# EAGLE design biosignal-daq-v1.0 (EAGLE 9.0.1)

## Sheet 1 of 2
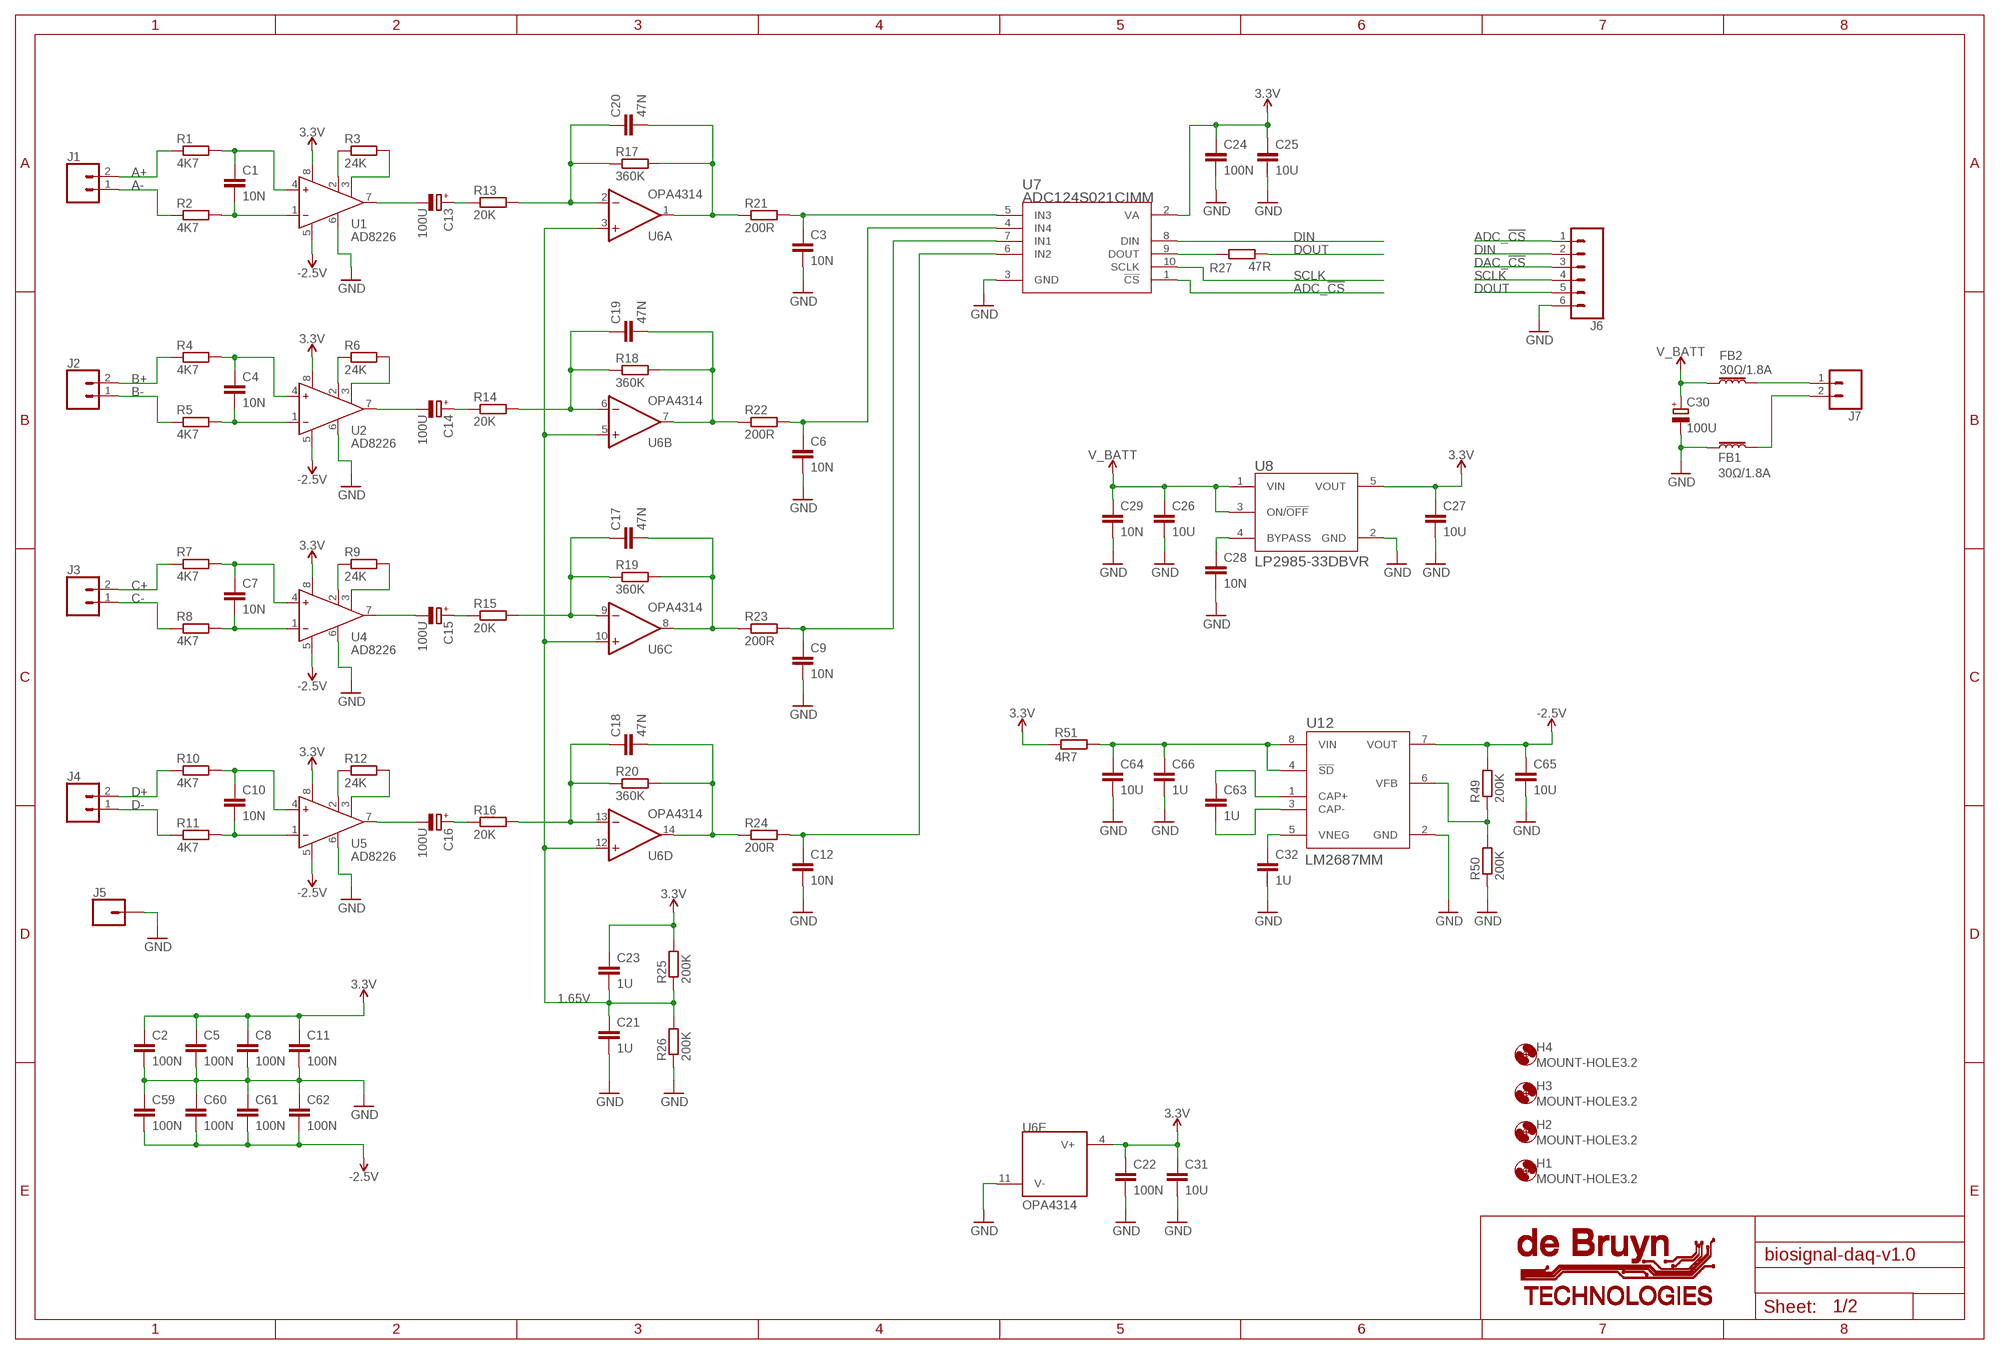
[diagram p0: schematic, sheet 1]

### Parts
C1  10N  C0603  [CAPC160X80X91L36N]
C2  100N  C0603  [CAPC160X80X91L36N]
C3  10N  C0603  [CAPC160X80X91L36N]
C4  10N  C0603  [CAPC160X80X91L36N]
C5  100N  C0603  [CAPC160X80X91L36N]
C6  10N  C0603  [CAPC160X80X91L36N]
C7  10N  C0603  [CAPC160X80X91L36N]
C8  100N  C0603  [CAPC160X80X91L36N]
C9  10N  C0603  [CAPC160X80X91L36N]
C10  10N  C0603  [CAPC160X80X91L36N]
C11  100N  C0603  [CAPC160X80X91L36N]
C12  10N  C0603  [CAPC160X80X91L36N]
C13  100U  CPOL-EUE2-5  [E2-5]
C14  100U  CPOL-EUE2-5  [E2-5]
C15  100U  CPOL-EUE2-5  [E2-5]
C16  100U  CPOL-EUE2-5  [E2-5]
C17  47N  C0805  [CAPC200X125X80L50N]
C18  47N  C0805  [CAPC200X125X80L50N]
C19  47N  C0805  [CAPC200X125X80L50N]
C20  47N  C0805  [CAPC200X125X80L50N]
C21  1U  C0603  [CAPC160X80X91L36N]
C22  100N  C0603  [CAPC160X80X91L36N]
C23  1U  C0603  [CAPC160X80X91L36N]
C24  100N  C0603  [CAPC160X80X91L36N]
C25  10U  C0805  [CAPC200X125X80L50N]
C26  10U  C0805  [CAPC200X125X80L50N]
C27  10U  C0805  [CAPC200X125X80L50N]
C28  10N  C0603  [CAPC160X80X91L36N]
C29  10N  C0603  [CAPC160X80X91L36N]
C30  100U  CPOL-EUE2-5  [E2-5]
C31  10U  C0805  [CAPC200X125X80L50N]
C32  1U  C0603  [CAPC160X80X91L36N]
C59  100N  C0603  [CAPC160X80X91L36N]
C60  100N  C0603  [CAPC160X80X91L36N]
C61  100N  C0603  [CAPC160X80X91L36N]
C62  100N  C0603  [CAPC160X80X91L36N]
C63  1U  C0603  [CAPC160X80X91L36N]
C64  10U  C0805  [CAPC200X125X80L50N]
C65  10U  C0805  [CAPC200X125X80L50N]
C66  1U  C0603  [CAPC160X80X91L36N]
FB1  30Ω/1.8A  FERRITE_BEAD-0603  [0603]
FB2  30Ω/1.8A  FERRITE_BEAD-0603  [0603]
H1  MOUNT-HOLE3.2  [3,2]
H2  MOUNT-HOLE3.2  [3,2]
H3  MOUNT-HOLE3.2  [3,2]
H4  MOUNT-HOLE3.2  [3,2]
J1  CONN_021X02_NO_SILK  [1X02_NO_SILK]
J2  CONN_021X02_NO_SILK  [1X02_NO_SILK]
J3  CONN_021X02_NO_SILK  [1X02_NO_SILK]
J4  CONN_021X02_NO_SILK  [1X02_NO_SILK]
J5  CONN_01  [1X01]
J6  CONN_06NO_SILK_NO_POP  [1X06_NO_SILK]
J7  CONN_021X02_NO_SILK  [1X02_NO_SILK]
R1  4K7  R0603  [RESC160X80X55L25N]
R2  4K7  R0603  [RESC160X80X55L25N]
R3  24K  R0603  [RESC160X80X55L25N]
R4  4K7  R0603  [RESC160X80X55L25N]
R5  4K7  R0603  [RESC160X80X55L25N]
R6  24K  R0603  [RESC160X80X55L25N]
R7  4K7  R0603  [RESC160X80X55L25N]
R8  4K7  R0603  [RESC160X80X55L25N]
R9  24K  R0603  [RESC160X80X55L25N]
R10  4K7  R0603  [RESC160X80X55L25N]
R11  4K7  R0603  [RESC160X80X55L25N]
R12  24K  R0603  [RESC160X80X55L25N]
R13  20K  R0603  [RESC160X80X55L25N]
R14  20K  R0603  [RESC160X80X55L25N]
R15  20K  R0603  [RESC160X80X55L25N]
R16  20K  R0603  [RESC160X80X55L25N]
R17  360K  R0603  [RESC160X80X55L25N]
R18  360K  R0603  [RESC160X80X55L25N]
R19  360K  R0603  [RESC160X80X55L25N]
R20  360K  R0603  [RESC160X80X55L25N]
R21  200R  R0603  [RESC160X80X55L25N]
R22  200R  R0603  [RESC160X80X55L25N]
R23  200R  R0603  [RESC160X80X55L25N]
R24  200R  R0603  [RESC160X80X55L25N]
R25  200K  R0603  [RESC160X80X55L25N]
R26  200K  R0603  [RESC160X80X55L25N]
R27  47R  R0603  [RESC160X80X55L25N]
R49  200K  R0603  [RESC160X80X55L25N]
R50  200K  R0603  [RESC160X80X55L25N]
R51  4R7  R0603  [RESC160X80X55L25N]
U1  AD8226  [SOP8P65_300X490X95L60X32N]
U2  AD8226  [SOP8P65_300X490X95L60X32N]
U4  AD8226  [SOP8P65_300X490X95L60X32N]
U5  AD8226  [SOP8P65_300X490X95L60X32N]
U6  OPA4314  [PW14]
U7  ADC124S021CIMM  [MUB10A]
U8  LP2985-33DBVR  [DBV5]
U12  LM2687MM  [MUA08A]

### Nets
1.65V: C21.1 C23.2 R25.1 R26.2 U6.3(A:+IN) U6.5(B:+IN) U6.10(C:+IN) U6.12(D:+IN)
3.3V: C2.1 C5.1 C8.1 C11.1 C22.1 C23.1 C24.1 C25.1 C27.1 C31.1 R25.2 R51.1 U1.8(+VS) U2.8(+VS) U4.8(+VS) U5.8(+VS) U6.4(E:V+) U7.2(VA) U8.5(VOUT) ; also sheet 2
-2.5V: C59.2 C60.2 C61.2 C62.2 C65.1 R49.2 U1.5(-VS) U2.5(-VS) U4.5(-VS) U5.5(-VS) U12.7(VOUT)
A+: J1.2 R1.1
A-: J1.1 R2.1
ADC_!CS: J6.1 U7.1(!CS)
B+: J2.2 R4.1
B-: J2.1 R5.1
C+: J3.2 R7.1
C-: J3.1 R8.1
D+: J4.2 R10.1
D-: J4.1 R11.1
DAC_!CS: J6.3 ; also sheet 2
DIN: J6.2 U7.8(DIN) ; also sheet 2
DOUT: J6.5 R27.2
GND: C2.2 C3.2 C5.2 C6.2 C8.2 C9.2 C11.2 C12.2 C21.2 C22.2 C24.2 C25.2 C26.2 C27.2 C28.2 C29.2 C30.- C31.2 C32.2 C59.1 C60.1 C61.1 C62.1 C64.2 C65.2 C66.2 FB1.1 J5.1 J6.6 R26.1 R50.1 U1.6(REF) U2.6(REF) U4.6(REF) U5.6(REF) U6.11(E:V-) U7.3(GND) U8.2(GND) U12.2(GND) ; also sheet 2
N$1: C1.1 R1.2 U1.4(IN+)
N$2: C1.2 R2.2 U1.1(IN-)
N$3: R3.1 U1.2(RG)
N$4: R3.2 U1.3(RG)
N$5: C4.1 R4.2 U2.4(IN+)
N$6: C4.2 R5.2 U2.1(IN-)
N$7: R6.1 U2.2(RG)
N$8: R6.2 U2.3(RG)
N$11: C7.1 R7.2 U4.4(IN+)
N$12: C7.2 R8.2 U4.1(IN-)
N$13: R9.1 U4.2(RG)
N$14: R9.2 U4.3(RG)
N$17: C10.1 R10.2 U5.4(IN+)
N$18: C10.2 R11.2 U5.1(IN-)
N$19: R12.1 U5.2(RG)
N$20: R12.2 U5.3(RG)
N$23: C13.- U1.7(VOUT)
N$24: C13.+ R13.1
N$27: C14.- U2.7(VOUT)
N$28: C14.+ R14.1
N$29: C15.- U4.7(VOUT)
N$30: C15.+ R15.1
N$31: C16.- U5.7(VOUT)
N$32: C16.+ R16.1
N$33: C6.1 R22.2 U7.4(IN4)
N$34: C19.1 R14.2 R18.1 U6.6(B:-IN)
N$35: C18.1 R16.2 R20.1 U6.13(D:-IN)
N$36: C18.2 R20.2 R24.1 U6.14(D:OUT)
N$37: C17.1 R15.2 R19.1 U6.9(C:-IN)
N$38: C17.2 R19.2 R23.1 U6.8(C:OUT)
N$39: C19.2 R18.2 R22.1 U6.7(B:OUT)
N$40: C20.1 R13.2 R17.1 U6.2(A:-IN)
N$41: C20.2 R17.2 R21.1 U6.1(A:OUT)
N$42: C9.1 R23.2 U7.7(IN1)
N$43: C12.1 R24.2 U7.6(IN2)
N$44: C3.1 R21.2 U7.5(IN3)
N$47: R27.1 U7.9(DOUT)
N$48: FB2.2 J7.1
N$49: FB1.2 J7.2
N$50: C28.1 U8.4(BYPASS)
N$81: R49.1 R50.2 U12.6(VFB)
N$82: C64.1 C66.1 R51.2 U12.4(!SD) U12.8(VIN)
N$83: C63.1 U12.1(CAP+)
N$85: C63.2 U12.3(CAP-)
N$86: C32.1 U12.5(VNEG)
SCLK: J6.4 U7.10(SCLK) ; also sheet 2
V_BATT: C26.1 C29.1 C30.+ FB2.1 U8.1(VIN) U8.3(ON/!OFF)

## Sheet 2 of 2
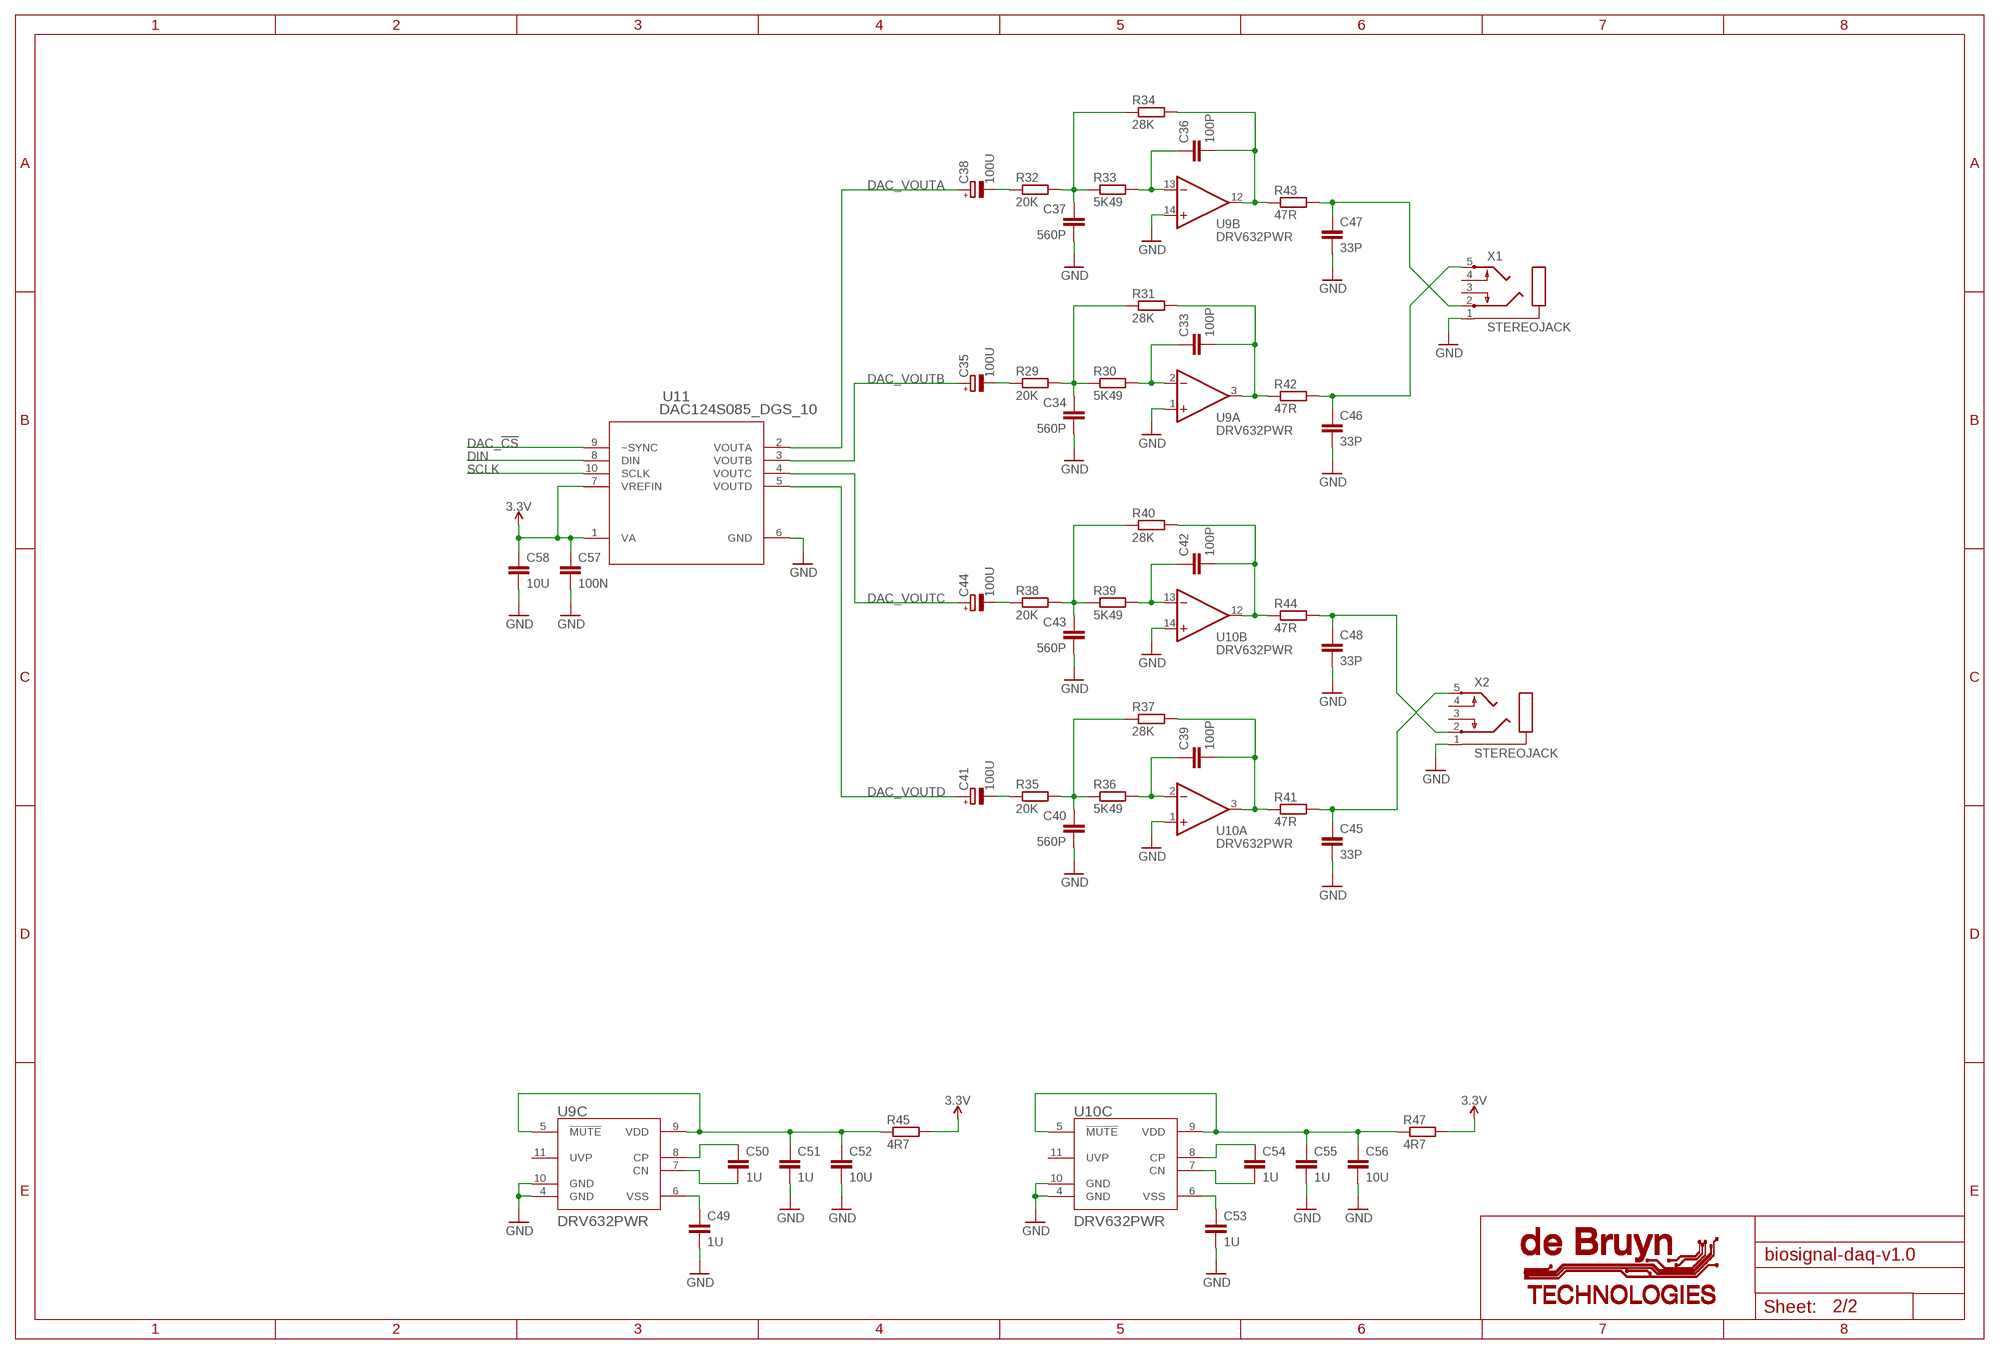
[diagram p1: schematic, sheet 2]

### Parts
C33  100P  C0603  [CAPC160X80X91L36N]
C34  560P  C0603  [CAPC160X80X91L36N]
C35  100U  CPOL-EUE2-5  [E2-5]
C36  100P  C0603  [CAPC160X80X91L36N]
C37  560P  C0603  [CAPC160X80X91L36N]
C38  100U  CPOL-EUE2-5  [E2-5]
C39  100P  C0603  [CAPC160X80X91L36N]
C40  560P  C0603  [CAPC160X80X91L36N]
C41  100U  CPOL-EUE2-5  [E2-5]
C42  100P  C0603  [CAPC160X80X91L36N]
C43  560P  C0603  [CAPC160X80X91L36N]
C44  100U  CPOL-EUE2-5  [E2-5]
C45  33P  C0603  [CAPC160X80X91L36N]
C46  33P  C0603  [CAPC160X80X91L36N]
C47  33P  C0603  [CAPC160X80X91L36N]
C48  33P  C0603  [CAPC160X80X91L36N]
C49  1U  C0603  [CAPC160X80X91L36N]
C50  1U  C0603  [CAPC160X80X91L36N]
C51  1U  C0603  [CAPC160X80X91L36N]
C52  10U  C0805  [CAPC200X125X80L50N]
C53  1U  C0603  [CAPC160X80X91L36N]
C54  1U  C0603  [CAPC160X80X91L36N]
C55  1U  C0603  [CAPC160X80X91L36N]
C56  10U  C0805  [CAPC200X125X80L50N]
C57  100N  C0603  [CAPC160X80X91L36N]
C58  10U  C0805  [CAPC200X125X80L50N]
R29  20K  R0603  [RESC160X80X55L25N]
R30  5K49  R0603  [RESC160X80X55L25N]
R31  28K  R0603  [RESC160X80X55L25N]
R32  20K  R0603  [RESC160X80X55L25N]
R33  5K49  R0603  [RESC160X80X55L25N]
R34  28K  R0603  [RESC160X80X55L25N]
R35  20K  R0603  [RESC160X80X55L25N]
R36  5K49  R0603  [RESC160X80X55L25N]
R37  28K  R0603  [RESC160X80X55L25N]
R38  20K  R0603  [RESC160X80X55L25N]
R39  5K49  R0603  [RESC160X80X55L25N]
R40  28K  R0603  [RESC160X80X55L25N]
R41  47R  R0603  [RESC160X80X55L25N]
R42  47R  R0603  [RESC160X80X55L25N]
R43  47R  R0603  [RESC160X80X55L25N]
R44  47R  R0603  [RESC160X80X55L25N]
R45  4R7  R0603  [RESC160X80X55L25N]
R47  4R7  R0603  [RESC160X80X55L25N]
U9  DRV632PWR  [PW14]
U10  DRV632PWR  [PW14]
U11  DAC124S085_DGS_10  [MUB10A]
X1  STEREOJACK  [STX3100]
X2  STEREOJACK  [STX3100]

### Nets
3.3V: C57.1 C58.1 R45.2 R47.2 U11.1(VA) U11.7(VREFIN) ; also sheet 1
DAC_!CS: U11.9(~SYNC) ; also sheet 1
DAC_VOUTA: C38.+ U11.2(VOUTA)
DAC_VOUTB: C35.+ U11.3(VOUTB)
DAC_VOUTC: C44.+ U11.4(VOUTC)
DAC_VOUTD: C41.+ U11.5(VOUTD)
DIN: U11.8(DIN) ; also sheet 1
GND: C34.2 C37.2 C40.2 C43.2 C45.2 C46.2 C47.2 C48.2 C49.2 C51.2 C52.2 C53.2 C55.2 C56.2 C57.2 C58.2 U9.1(A:+IN) U9.4(C:GND) U9.10(C:GND) U9.14(B:+IN) U10.1(A:+IN) U10.4(C:GND) U10.10(C:GND) U10.14(B:+IN) U11.6(GND) X1.1 X2.1 ; also sheet 1
N$45: C47.1 R43.2 X1.2
N$46: C34.1 R29.2 R30.1 R31.1
N$52: C33.1 R30.2 U9.2(A:-IN)
N$53: C33.2 R31.2 R42.1 U9.3(A:OUT)
N$54: C35.- R29.1
N$55: C37.1 R32.2 R33.1 R34.1
N$56: C36.1 R33.2 U9.13(B:-IN)
N$57: C36.2 R34.2 R43.1 U9.12(B:OUT)
N$58: C38.- R32.1
N$59: C40.1 R35.2 R36.1 R37.1
N$60: C39.1 R36.2 U10.2(A:-IN)
N$61: C39.2 R37.2 R41.1 U10.3(A:OUT)
N$62: C41.- R35.1
N$63: C43.1 R38.2 R39.1 R40.1
N$64: C42.1 R39.2 U10.13(B:-IN)
N$65: C42.2 R40.2 R44.1 U10.12(B:OUT)
N$66: C44.- R38.1
N$67: C45.1 R41.2 X2.5
N$68: C46.1 R42.2 X1.5
N$70: C48.1 R44.2 X2.2
N$71: C50.1 U9.8(C:CP)
N$72: C50.2 U9.7(C:CN)
N$73: C49.1 U9.6(C:VSS)
N$75: C51.1 C52.1 R45.1 U9.5(C:!MUTE) U9.9(C:VDD)
N$76: C54.1 U10.8(C:CP)
N$77: C54.2 U10.7(C:CN)
N$78: C53.1 U10.6(C:VSS)
N$80: C55.1 C56.1 R47.1 U10.5(C:!MUTE) U10.9(C:VDD)
SCLK: U11.10(SCLK) ; also sheet 1
Unconnected: U9.11(C:UVP) U10.11(C:UVP) X1.3 X1.4 X2.3 X2.4

## Library data of the parts
C1 C3 C4 C6 C7 C9 C10 C12 C17-C21 C23 C25-C29 C31-C34 C36 C37 C39 C40 C42 C43 C45-C58 C63-C66 = plantsensor:C
C2 C5 C8 C11 C22 C24 C59-C62 = plantsensor:C; MANUFACTURER_PART_NUMBER: MC0603B104K100CT; RATING: 10V; TECHNOLOGY: X7R; TOLERANCE: 10%; VENDOR: Multicomp
C13-C16 C30 C35 C38 C41 C44 = rcl:CPOL-EU: POLARIZED CAPACITOR, European symbol; SPICEPREFIX: C
FB1 FB2 = SparkFun-Coils:FERRITE_BEAD: Ferrite Bead (blocks, cores, rings, chokes, etc.) Inductor with layers of ferrite used to suppress high frequencies. Often used to isolate high frequency noise. SparkFun Products: IOIO-OTG - V2.2 <https://www.sparkfun.com/products/13613> SparkFun SAMD21 Mini Breakout <https://www.sparkfun.com/products/13664> SparkFun 6 Degrees of Freedom Breakout - LSM6DS3 <https://www.sparkfun.com/products/13339> SparkFun SAMD21 Dev Breakout <https://www.sparkfun.com/products/13672>; PROD_ID: NDUC-07859
H1-H4 = holes:MOUNT-HOLE: MOUNTING HOLE with drill center marker
J1-J4 J7 = SparkFun-Connectors:CONN_02: Multi connection point. Often used as Generic Header-pin footprint for 0.1 inch spaced/style header connections On any of the 0.1 inch spaced packages, you can populate with these: Break Away Headers - Straight <https://www.sparkfun.com/products/116> (PRT-00116) Break Away Male Headers - Right Angle <https://www.sparkfun.com/products/553> (PRT-00553) Female Headers <https://www.sparkfun.com/products/115> (PRT-00115) Break Away Headers - Machine Pin <https://www.sparkfun.com/products/117> (PRT-00117) Break Away Female Headers - Swiss Machine Pin <https://www.sparkfun.com/products/743> (PRT-00743) For SCREWTERMINALS and SPRING TERMINALS visit here: Screw Terimnals on SparkFun.com <https://www.sparkfun.com/search/results?term=Screw+Terminals> (5mm/3.5mm/2.54mm spacing) This device is also useful as a general connection point to wire up your design to another part of your project. Our various solder wires solder well into these plated through hole pads. Hook-Up Wire - Assortment (Stranded, 22 AWG) <https://www.sparkfun.com/products/11375> (PRT-11375) Hook-Up Wire - Assortment (Solid Core, 22 AWG) <https://www.sparkfun.com/products/11367> (PRT-11367) View the entire wire category on our website here <https://www.sparkfun.com/categories/141> Special notes: Molex polarized connector foot print use with: PRT-08233 with associated crimp pins and housings. 2.54_SCREWTERM for use with PRT-10571. 3.5mm Screw Terminal footprints for PRT-08084 5mm Screw Terminal footprints for use with PRT-08432
J5 = SparkFun-Connectors:CONN_01: Single connection point. Often used as Generic Header-pin footprint for 0.1 inch spaced/style header connections On any of the 0.1 inch spaced packages, you can populate with these: Break Away Headers - Straight <https://www.sparkfun.com/products/116> (PRT-00116) Break Away Male Headers - Right Angle <https://www.sparkfun.com/products/553> (PRT-00553) Female Headers <https://www.sparkfun.com/products/115> (PRT-00115) Break Away Headers - Machine Pin <https://www.sparkfun.com/products/117> (PRT-00117) Break Away Female Headers - Swiss Machine Pin <https://www.sparkfun.com/products/743> (PRT-00743) This device is also useful as a general connection point to wire up your design to another part of your project. Our various solder wires solder well into these plated through hole pads. Hook-Up Wire - Assortment (Stranded, 22 AWG) <https://www.sparkfun.com/products/11375> (PRT-11375) Hook-Up Wire - Assortment (Solid Core, 22 AWG) <https://www.sparkfun.com/products/11367> (PRT-11367) View the entire wire category on our website here <https://www.sparkfun.com/categories/141> Special notes: SMTSO-256-ET is a "flush mount" nut for a 4-40 screw. We mostly use this on specialty testbeds; it is a nice way to connect hardware to your PCB at an adjustable hieght. Also note, the SNAP packages are for using a snappable style connector. We sell a baggie of snaps and they are also used on two LilyPad designs: Snap Assortment - 30 pack (male and female) <https://www.sparkfun.com/products/11347> (DEV-11347) LilyPad Arduino SimpleSnap <https://www.sparkfun.com/products/10941> (DEV-10941) LilyPad SimpleSnap Protoboard <https://www.sparkfun.com/products/10940> (DEV-10940)
J6 = SparkFun-Connectors:CONN_06: Multi connection point. Often used as Generic Header-pin footprint for 0.1 inch spaced/style header connections On any of the 0.1 inch spaced packages, you can populate with these: Break Away Headers - Straight <https://www.sparkfun.com/products/116> (PRT-00116) Break Away Male Headers - Right Angle <https://www.sparkfun.com/products/553> (PRT-00553) Female Headers <https://www.sparkfun.com/products/115> (PRT-00115) Break Away Headers - Machine Pin <https://www.sparkfun.com/products/117> (PRT-00117) Break Away Female Headers - Swiss Machine Pin <https://www.sparkfun.com/products/743> (PRT-00743) Arduino Stackable Header - 6 Pin <https://www.sparkfun.com/products/9280> (PRT-09280) For SCREWTERMINALS and SPRING TERMINALS visit here: Screw Terimnals on SparkFun.com <https://www.sparkfun.com/search/results?term=Screw+Terminals> (5mm/3.5mm/2.54mm spacing) This device is also useful as a general connection point to wire up your design to another part of your project. Our various solder wires solder well into these plated through hole pads. Hook-Up Wire - Assortment (Stranded, 22 AWG) <https://www.sparkfun.com/products/11375> (PRT-11375) Hook-Up Wire - Assortment (Solid Core, 22 AWG) <https://www.sparkfun.com/products/11367> (PRT-11367) View the entire wire category on our website here <https://www.sparkfun.com/categories/141>
R1-R4 = plantsensor:R; RATING: 100mW; TOLERANCE: 1%
R5-R27 R29-R45 R47 R49-R51 = plantsensor:R
U1 U2 U4 U5 = plantsensor:AD8226
U6 = plantsensor:OPA4314
U7 = plantsensor:ADC124S021CIMM; MANUFACTURER_PART_NUMBER: ADC124S021CIMM; VENDOR: Texas Instruments
U8 = plantsensor:LP2985-33DBVR; MANUFACTURER_PART_NUMBER: LP298533DBVR; VENDOR: Texas Instruments
U9 U10 = plantsensor:DRV632PWR; MANUFACTURER_PART_NUMBER: DRV632PWR; VENDOR: Texas Instruments
U11 = plantsensor:DAC124S085_DGS_10; MANUFACTURER_PART_NUMBER: DAC124S085_DGS_10; VENDOR: Texas Instruments
U12 = plantsensor:LM2687MM; MANUFACTURER_PART_NUMBER: LM2687MM; VENDOR: Texas Instruments
X1 X2 = audio amplifier example:STEREOJACK: MIC/HEADPHONE JACK Stereo jack with two switches. Kycon STX3100, CUI SJ1-3555NG and/or 4UCon 05544

## Board
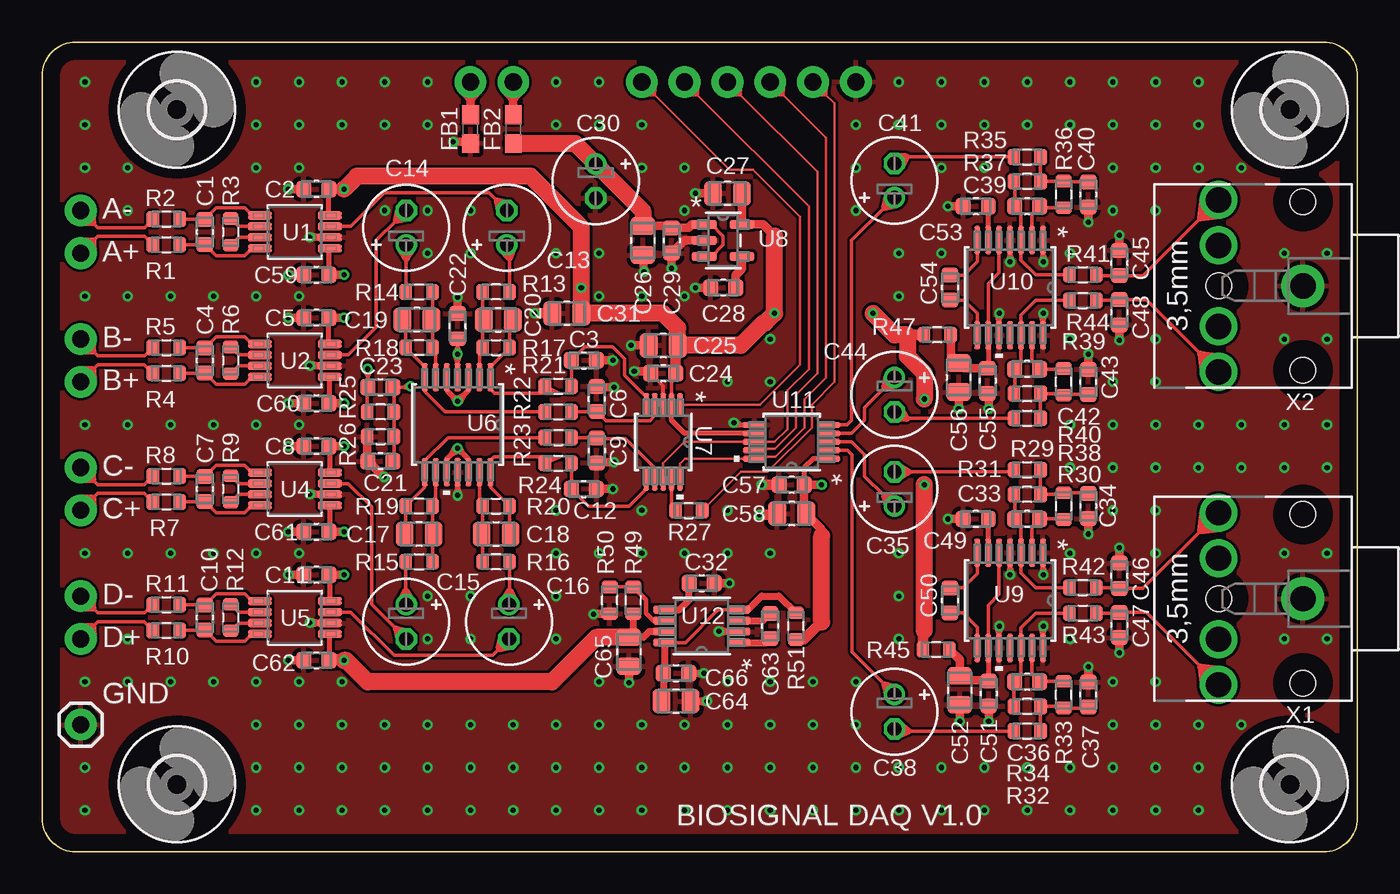
[diagram p2: board, top side]
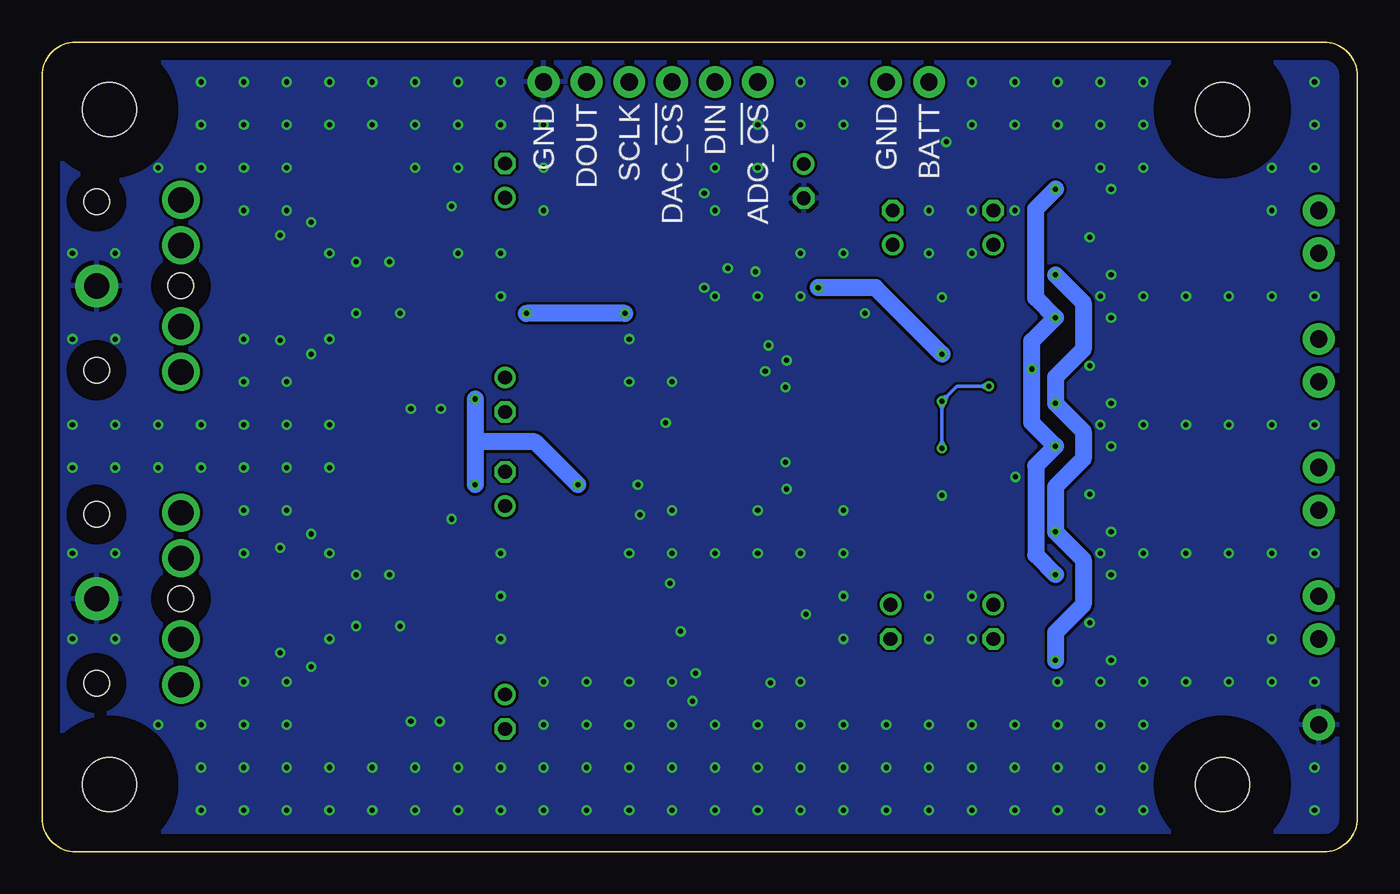
[diagram p3: board, bottom side, seen from below]

Size 78 x 48 mm. Coordinates in mm from the lower left corner, seen from the top.
Outline: 0,2 0,46 arc-90 2,48 76,48 arc-90 78,46 78,2 arc-90 76,0 2,0 arc-90 0,2
Copper layers (1*16): Top 0.035mm / dielectric 1.5mm / Bottom 0.035mm
Design rules "default *": minimum track width 6mil, minimum drill 0.3mm, track to track 6mil, track to pad 6mil, pad to pad 6mil, via to via 6mil, smd to smd 6mil, copper to edge 40mil, drill to drill 6mil, minimum pad ring 6mil, minimum via ring 6mil, stop-mask expansion 0.07mm, vias tented up to drill 0.3mm, thermal gap 10mil

### Footprints (pad centres in the part's own frame; a part is rotated, then mirrored left to right if it is on the bottom)
CAPC160X80X91L36N = smd 0.88 x 0.97: 1 -0.745,0; 2 0.745,0
E2-5 = drill 0.813 pad 1.27: + -1.016,0 | drill 0.813 pad 1.27 octagon: - 1.016,0
CAPC200X125X80L50N = smd 1.05 x 1.42: 1 -0.86,0; 2 0.86,0
0603 = smd 1.1 x 1: 1 -0.85,0; 2 0.85,0
3,2 = hole 3.2: 0,0
1X02_NO_SILK = drill 1.016 pad 1.88: 1 0,0; 2 2.54,0
1X01 = drill 1.016 pad 1.88: 1 0,0
1X06_NO_SILK = drill 1.016 pad 1.88: 1 0,0; 2 2.54,0; 3 5.08,0; 4 7.62,0; 5 10.16,0; 6 12.7,0
RESC160X80X55L25N = smd 0.74 x 0.93: 1 -0.795,0; 2 0.795,0
SOP8P65_300X490X95L60X32N = smd 0.48 x 1.42: 1 -0.975,-2.07; 2 -0.325,-2.07; 3 0.325,-2.07; 4 0.975,-2.07; 5 0.975,2.07; 6 0.325,2.07; 7 -0.325,2.07; 8 -0.975,2.07
PW14 = smd 1.676 x 0.356: 1 -2.819,1.95; 2 -2.819,1.3; 3 -2.819,0.65; 4 -2.819,0; 5 -2.819,-0.65; 6 -2.819,-1.3; 7 -2.819,-1.95; 8 2.819,-1.95; 9 2.819,-1.3; 10 2.819,-0.65; 11 2.819,0; 12 2.819,0.65; 13 2.819,1.3; 14 2.819,1.95
MUB10A = smd 1.372 x 0.33: 1 -2.197,1; 2 -2.197,0.5; 3 -2.197,0; 4 -2.197,-0.5; 5 -2.197,-1; 6 2.197,-1; 7 2.197,-0.5; 8 2.197,0; 9 2.197,0.5; 10 2.197,1
DBV5 = smd 1.473 x 0.559: 1 -1.118,0.95; 2 -1.118,0; 3 -1.118,-0.95; 4 1.118,-0.95; 5 1.118,0.95
MUA08A = smd 1.372 x 0.457: 1 -2.197,0.975; 2 -2.197,0.325; 3 -2.197,-0.325; 4 -2.197,-0.975; 5 2.197,-0.975; 6 2.197,-0.325; 7 2.197,0.325; 8 2.197,0.975
STX3100 = drill 1.5 pad 2.54: 1 2.7,-0.1 | drill 1.5: 2 7.7,5; 3 7.7,2.3; 4 7.7,-2.5; 5 7.7,-5.2 | hole 1.5: 2.7,4.9; 2.7,-5.1; 7.7,-0.1

### Placement (x,y rotation side)
C1  9.65,36.75 90 top
C2  16.26,39.29 180 top
C3  32.13,29.13 0 top
C4  9.65,29.13 90 top
C5  16.26,31.67 180 top
C6  32.89,26.84 90 top
C7  9.65,21.51 90 top
C8  16.26,24.05 180 top
C9  32.89,23.8 270 top
C10  9.65,13.89 90 top
C11  16.26,16.43 180 top
C12  32.13,21.51 0 top
C13  27.56,37 90 top
C14  21.59,37 90 top
C15  21.59,13.64 270 top
C16  27.69,13.64 270 top
C17  22.35,18.84 180 top
C18  26.92,18.84 0 top
C19  22.23,31.54 180 top
C20  27.05,31.54 0 top
C21  20.07,23.16 180 top
C22  24.64,31.16 90 top
C23  20.07,27.54 0 top
C24  36.83,28.37 180 top
C25  36.83,30.02 180 top
C26  35.62,36.24 270 top
C27  40.64,39.04 180 top
C28  40.39,33.45 180 top
C29  37.34,36.24 270 top
C30  32.83,39.77 270 top
C31  31.11,31.92 180 top
C32  39.12,15.92 0 top
C33  58.42,19.73 180 top
C34  62.04,20.49 270 top
C35  50.55,21.51 90 top
C36  58.42,10.08 180 top
C37  62.04,9.32 90 top
C38  50.55,8.3 270 top
C39  58.42,38.27 180 top
C40  62.04,38.97 270 top
C41  50.55,39.8 90 top
C42  58.42,28.62 180 top
C43  62.04,27.86 90 top
C44  50.55,27.1 270 top
C45  63.88,34.91 90 top
C46  63.88,16.37 90 top
C47  63.88,13.45 270 top
C48  63.88,31.99 270 top
C49  55.37,19.73 180 top
C50  53.85,14.91 90 top
C51  56.13,9.38 270 top
C52  54.42,9.57 270 top
C53  55.37,38.27 180 top
C54  53.85,33.45 90 top
C55  56.07,27.92 270 top
C56  54.36,28.11 270 top
C57  44.45,21.76 180 top
C58  44.45,20.05 180 top
C59  16.26,34.21 0 top
C60  16.26,26.59 0 top
C61  16.26,18.97 0 top
C62  16.26,11.35 0 top
C63  43.18,13.38 90 top
C64  37.59,8.94 0 top
C65  34.8,11.86 270 top
C66  37.59,10.59 0 top
FB1  25.4,42.85 90 top
FB2  27.94,42.85 90 top
H1  74,4 0 top
H2  74,44 0 top
H3  8,4 0 top
H4  8,44 0 top
J1  2.29,38.02 270 top
J2  2.29,30.4 270 top
J3  2.29,22.78 270 top
J4  2.29,15.16 270 top
J5  2.29,7.54 0 top
J6  35.56,45.64 0 top
J7  27.94,45.64 180 top
R1  7.37,35.99 0 top
R2  7.37,37.51 0 top
R3  11.18,36.75 270 top
R4  7.37,28.37 0 top
R5  7.37,29.89 0 top
R6  11.18,29.13 270 top
R7  7.37,20.75 0 top
R8  7.37,22.27 0 top
R9  11.18,21.51 270 top
R10  7.37,13.13 0 top
R11  7.37,14.65 0 top
R12  11.18,13.89 270 top
R13  26.92,33.19 180 top
R14  22.35,33.19 0 top
R15  22.35,17.19 0 top
R16  26.92,17.19 180 top
R17  26.92,29.89 0 top
R18  22.35,29.89 180 top
R19  22.35,20.49 180 top
R20  26.92,20.49 0 top
R21  30.61,27.61 0 top
R22  30.61,26.08 0 top
R23  30.61,24.56 0 top
R24  30.61,23.03 0 top
R25  20.07,26.08 180 top
R26  20.07,24.62 0 top
R27  38.35,20.24 0 top
R29  58.42,22.65 0 top
R30  60.58,20.49 270 top
R31  58.42,21.19 180 top
R32  58.42,7.16 0 top
R33  60.58,9.32 90 top
R34  58.42,8.62 180 top
R35  58.42,41.2 0 top
R36  60.58,38.97 270 top
R37  58.42,39.73 180 top
R38  58.42,25.7 0 top
R39  60.58,27.86 90 top
R40  58.42,27.16 180 top
R41  61.72,34.21 0 top
R42  61.72,15.67 0 top
R43  61.72,14.14 0 top
R44  61.72,32.69 0 top
R45  53.02,11.98 180 top
R47  53.09,30.65 180 top
R49  35.05,14.91 270 top
R50  33.66,14.91 90 top
R51  44.7,13.38 90 top
U1  14.99,36.75 270 top
U2  14.99,29.13 270 top
U4  14.99,21.51 270 top
U5  14.99,13.89 270 top
U6  24.64,25.32 270 top
U7  36.83,24.3 270 top
U8  40.39,36.24 0 top
U9  57.4,14.91 270 top
U10  57.4,33.45 270 top
U11  44.45,24.3 180 top
U12  39.12,13.38 180 top
X1  77.47,14.91 180 top
X2  77.47,33.45 180 top

### Tracks (layer width: path | path; a pad name or v marks a point on that pad's centre or on a via)
1.65V  (via drill 0.3)
  Top 0.203: 20.86,27.49 R25.1 R26.2 20.86,23.21 | C23.2 21.4,27.54 | 21.4,27.54 21.65,27.54 v21.84,27.61 | 21.4,27.54 21.78,27.41 v21.84,27.61 | 21.4,27.54 21.73,27.77 v21.84,27.61
  Top 0.305: 24.01,22.52 U6.10 23.99,23.27 24.32,23.61 | U6.5 23.99,27.37 24.32,27.04 | 24.32,27.04 v24.64,26.72 | U6.3 25.29,27.37 24.96,27.04 | 24.96,27.04 v24.64,26.72 | 24.32,23.61 v24.64,23.92 | U6.12 25.29,23.27 24.96,23.61 | 24.96,23.61 v24.64,23.92 | 24.32,27.04 24.5,26.65 v24.64,26.72 | 24.32,27.04 24.7,26.85 v24.64,26.72 | 24.96,27.04 24.57,26.85 v24.64,26.72 | 24.96,27.04 24.77,26.65 v24.64,26.72 | 24.32,23.61 24.7,23.79 v24.64,23.92 | 24.32,23.61 24.5,23.99 v24.64,23.92 | 24.96,23.61 24.77,23.99 v24.64,23.92 | 24.96,23.61 24.57,23.79 v24.64,23.92
  Top 0.508: C23.2 20.86,27.49 | 20.86,23.21 C21.1
  Bottom 0.203: v21.84,27.61 22.29,27.61 | 22.29,27.61 23.75,27.61 24.32,27.04 | 24.32,27.04 v24.64,26.72 | v24.64,26.72 24.64,26.27 | 24.64,26.27 24.64,24.37 | 24.64,24.37 v24.64,23.92 | 24.64,26.27 24.82,26.63 | v24.64,26.72 24.82,26.63 | 24.64,26.27 24.46,26.63 | v24.64,26.72 24.46,26.63 | 24.32,27.04 24.45,26.65 v24.64,26.72 | 24.32,27.04 24.7,26.91 v24.64,26.72 | 24.64,26.27 24.82,26.63 | 24.64,26.27 24.46,26.63 | 24.64,26.27 24.82,26.63 | v24.64,26.72 24.82,26.63 | 24.64,26.27 24.46,26.63 | v24.64,26.72 24.46,26.63 | 24.64,24.37 | 24.64,24.37 24.46,24.01 | v24.64,23.92 24.46,24.01 | 24.64,24.37 | 24.64,24.37 24.82,24.01 | v24.64,23.92 24.82,24.01 | 24.64,24.37 24.46,24.01 | 24.64,24.37 24.82,24.01 | 24.64,24.37 24.46,24.01 | v24.64,23.92 24.46,24.01 | 24.64,24.37 24.82,24.01 | v24.64,23.92 24.82,24.01 | 22.29,27.61 21.93,27.79 | v21.84,27.61 21.93,27.79 | 22.29,27.61 21.93,27.43 | v21.84,27.61 21.93,27.43 | 22.29,27.61 21.93,27.79 | 22.29,27.61 21.93,27.43 | 22.29,27.61 21.93,27.79 | v21.84,27.61 21.93,27.79 | 22.29,27.61 21.93,27.43 | v21.84,27.61 21.93,27.43
3.3V  (via drill 0.3)
  Top 0.203: C24.1 37.33,28.12 37.33,26.59 U7.2 | v24.64,29.51 24.64,29.96 | 24.64,29.96 C22.1 | R25.2 19.27,27.49 | C23.1 19.32,28.17 | 19.32,28.17 19.32,28.61 v19.3,28.62 | 24.64,29.96 | 24.64,29.96 24.46,29.6 | v24.64,29.51 24.46,29.6 | 24.64,29.96 | 24.64,29.96 24.82,29.6 | v24.64,29.51 24.82,29.6 | 24.64,29.96 24.46,29.6 | 24.64,29.96 24.82,29.6 | 24.64,29.96 24.46,29.6 | v24.64,29.51 24.46,29.6 | 24.64,29.96 24.82,29.6 | v24.64,29.51 24.82,29.6 | 19.32,28.17 19.49,28.54 v19.3,28.62 | 19.32,28.17 19.13,28.53 v19.3,28.62
  Top 0.305: U6.4 24.64,29.06 | 24.64,29.06 v24.64,29.51 | U1.8 17,37.78 C2.1 | C5.1 17,30.16 U2.8 | U4.8 17.06,24 C8.1 | U5.8 17.06,16.38 C11.1 | U11.1 45.74,23.3 45.2,22.76 C57.1 | U11.7 38.11,24.8 37.33,25.58 37.33,26.59 | 24.64,29.06 24.78,29.46 | 24.78,29.46 | v24.64,29.51 24.78,29.46 | 24.64,29.06 24.5,29.46 | v24.64,29.51 24.5,29.46 | 24.64,29.06 24.78,29.46 | v24.64,29.51 24.78,29.46 | 24.64,29.06 24.5,29.46 | v24.64,29.51 24.5,29.46
  Top 0.508: C8.1 v17.91,24.05 | C5.1 v17.91,31.67 | C2.1 v17.91,39.29 | C11.1 v17.91,16.43 | 19.27,27.49 C23.1 | 41.5,38.53 U8.5 42.74,37.19 43.43,36.5 | 41.5,38.53 41.5,39.01 41.49,39.03 | R51.1 45.18,12.59 | 46.23,18.72 46.23,19.13 C58.1 45.2,20.16 C57.1 v46.23,21.76 | C27.1 41.5,38.53
  Top 0.61: C25.1 37.58,29.9 C24.1 | R47.2 51.31,30.65 | R45.2 52.23,13.03 52.32,13.13 | 45.18,12.59 46.23,13.64
  Top 1.016: 43.43,36.5 v43.43,31.92 42.87,31.36 42.78,31.36 41.44,30.02 C25.1 37.69,31.06 36.83,31.92 C31.1 v31.98,33.45 31.98,37.03 28.96,40.05 18.67,40.05 v17.91,39.29 | v49.28,31.92 50.55,30.65 51.31,30.65 51.31,29.38 52.32,28.37 v52.32,26.84 | 52.32,13.13 v52.32,21.76 | 46.23,13.64 46.23,18.72
  Bottom 1.016: v17.91,39.29 19.07,38.12 19.07,32.84 v17.91,31.67 19.3,30.27 v19.3,28.62 19.3,25.45 v17.91,24.05 19.07,22.88 19.07,17.6 v17.91,16.43 | v24.64,29.51 28.57,33.45 v31.98,33.45 | v43.43,31.92 v49.28,31.92 | v52.32,26.84 52.32,24.3 | 52.32,24.3 v52.32,21.76 | v46.23,21.76 48.77,24.3 52.32,24.3
-2.5V  (via drill 0.3)
  Top 0.305: U1.5 17,35.72 C59.2 | U2.5 17.06,26.64 C60.2 | U4.5 17.06,19.02 C61.2 | U5.5 17.06,11.41 C62.2
  Top 0.406: U12.7 36,13.06 35.66,12.72 35.05,12.72 | 35.05,12.72 C65.1 | R49.2 35.05,12.72
  Top 0.508: C60.2 v17.91,26.59 | C59.2 v17.91,34.21 | C61.2 v17.91,18.97 | C62.2 v17.91,11.35
  Top 0.61: v17.91,11.35 17.85,11.41 17.06,11.41
  Top 1.016: C65.1 32.86,12.72 30.23,10.08 19.3,10.08 18.03,11.35 v17.91,11.35
  Bottom 1.016: v17.91,34.21 16.26,32.56 16.26,29.79 17.91,28.14 v17.91,26.59 16.26,24.94 16.26,23.29 17.91,21.64 v17.91,18.97 16.26,17.32 16.26,14.65 17.91,13 v17.91,11.35
A+
  Top 0.203: R1.1 6.57,36.02 6.1,36.5 3.3,36.5 3,36.2 J1.2
  Top 0.406: 3,36.2 2.31,36.22 J1.2 3.02,35.5 3,36.2
A-
  Top 0.203: R2.1 6.57,37.48 6.1,37 3.3,37 3,37.3 J1.1
  Top 0.406: 3,37.3 3.02,38 J1.1 2.31,37.28 3,37.3
ADC_!CS
  Top 0.152: J6.1 36.28,44.92 40.77,40.43 42.16,40.43 44.96,37.64 44.96,28.88 42.58,26.5 U7.1
  Top 0.203: U7.1 37.83,26.95
  Top 0.305: 36.28,44.92 36.34,45.56 J6.1 35.64,44.86 36.28,44.92
B+
  Top 0.203: R4.1 6.06,28.88 3.3,28.88 3,28.58 J2.2
  Top 0.406: 3,28.58 2.31,28.6 J2.2 3.02,27.88 3,28.58
B-
  Top 0.203: R5.1 6.08,29.4 3.29,29.4 3,29.68 J2.1
  Top 0.406: 3,29.68 3.02,30.38 J2.1 2.31,29.66 3,29.68
C+
  Top 0.152: 6.08,21.24 6.06,21.26
  Top 0.203: R7.1 6.08,21.24 | 6.06,21.26 3.3,21.26 3,20.96 J3.2
  Top 0.406: 3,20.96 2.31,20.98 J3.2 3.02,20.26 3,20.96
C-
  Top 0.203: R8.1 6.06,21.76 3.3,21.76 3,22.06 J3.1
  Top 0.406: 3,22.06 3.02,22.76 J3.1 2.31,22.04 3,22.06
D+
  Top 0.203: R10.1 6.06,13.64 3.3,13.64 3,13.34 J4.2
  Top 0.406: 3,13.34 2.31,13.36 J4.2 3.02,12.64 3,13.34
D-
  Top 0.203: R11.1 6.08,14.16 3.29,14.16 3,14.44 J4.1
  Top 0.406: 3,14.44 3.02,15.14 J4.1 2.31,14.42 3,14.44
DAC_!CS
  Top 0.152: U11.9 42.36,23.91 43.47,23.91 44.7,25.14 44.7,27.1 45.97,28.37 45.97,40.31 41.36,44.92 J6.3
  Top 0.305: 41.36,44.92 41.42,45.56 J6.3 40.72,44.86 41.36,44.92
DAC_VOUTA
  Top 0.203: C38.+ 49.97,9.89 48.01,11.85 48.01,23.54 47.75,23.8 U11.2
  Top 0.406: 49.97,9.89 50.12,9.22 C38.+ 50.64,9.74 49.97,9.89
DAC_VOUTB
  Top 0.203: U11.3 48.01,24.3 48.77,23.54 48.77,22.27 49.97,21.07 C35.+
  Top 0.406: 49.97,21.07 50.12,20.4 C35.+ 50.64,20.91 49.97,21.07
DAC_VOUTC
  Top 0.203: U11.4 48,24.8 48.77,25.57 48.77,26.34 49.97,27.54 C44.+
  Top 0.406: 49.97,27.54 50.64,27.69 C44.+ 50.12,28.21 49.97,27.54
DAC_VOUTD
  Top 0.203: U11.5 47.74,25.3 48.01,25.57 48.01,36.24 49.97,38.21 C41.+
  Top 0.406: 49.97,38.21 50.64,38.36 C41.+ 50.12,38.88 49.97,38.21
DIN
  Top 0.152: U7.8 36.83,23.03 38.1,24.3 U11.8 43.43,24.3 44.2,25.07 44.2,27.35 45.47,28.62 45.47,38.27 38.82,44.92 J6.2
  Top 0.305: 38.82,44.92 38.88,45.56 J6.2 38.18,44.86 38.82,44.92
DOUT
  Top 0.152: R27.2 41.44,22.53 43.03,22.53 45.64,25.14 45.64,26.51 46.99,27.86 46.99,44.37 46.44,44.92 J6.5
  Top 0.305: 46.44,44.92 46.5,45.56 J6.5 45.8,44.86 46.44,44.92
GND  (via drill 0.3)
  Top 0.203: C24.2 36.83,27.62 U7.3 | 19.27,23.29 19.27,23.21
  Top 0.305: U6.11 24.64,21.58 | 24.64,21.58 v24.64,21.13 | v41.02,25.44 41.15,25.3 41.45,25.3 | 41.45,25.3 U11.6 | U10.10 56.75,31.47 | 56.75,31.47 56.75,31.78 v56.77,31.92 | U10.4 57.4,35.42 | 57.4,35.42 v57.4,34.97 | U10.1 59.35,35.42 | 59.35,35.42 59.35,34.99 v59.37,34.97 | U10.14 59.35,31.47 | 59.35,31.47 59.35,31.84 v59.37,31.92 | U9.4 57.4,16.88 | 57.4,16.88 v57.4,16.43 | U9.1 59.35,16.88 | 59.35,16.88 59.35,16.51 v59.37,16.43 | U9.10 56.75,12.93 | 56.75,12.93 56.75,13.37 v56.77,13.38 | U9.14 59.35,12.93 | 59.35,12.93 59.35,13.3 v59.37,13.38 | 24.64,21.58 24.5,21.18 | v24.64,21.13 24.5,21.18 | 24.64,21.58 24.78,21.18 | v24.64,21.13 24.78,21.18 | 24.64,21.58 24.5,21.18 | 24.5,21.18 | v24.64,21.13 24.5,21.18 | 24.64,21.58 24.78,21.18 | v24.64,21.13 24.78,21.18 | 24.64,21.58 24.5,21.18 | v24.64,21.13 24.5,21.18 | 24.64,21.58 24.78,21.18 | v24.64,21.13 24.78,21.18 | 41.45,25.3 41.11,25.56 v41.02,25.44 | 41.45,25.3 41.03,25.29 v41.02,25.44 | 56.75,31.47 56.91,31.87 v56.77,31.92 | 56.75,31.47 56.63,31.88 v56.77,31.92 | 57.4,35.42 57.26,35.02 | v57.4,34.97 57.26,35.02 | 57.4,35.42 57.55,35.02 | v57.4,34.97 57.55,35.02 | 57.4,35.42 57.26,35.02 | 57.26,35.02 | v57.4,34.97 57.26,35.02 | 57.4,35.42 57.55,35.02 | v57.4,34.97 57.55,35.02 | 57.4,35.42 57.26,35.02 | v57.4,34.97 57.26,35.02 | 57.4,35.42 57.55,35.02 | v57.4,34.97 57.55,35.02 | 59.35,35.42 59.23,35.02 v59.37,34.97 | 59.35,35.42 59.51,35.03 v59.37,34.97 | 59.35,31.47 59.51,31.87 v59.37,31.92 | 59.35,31.47 59.23,31.88 v59.37,31.92 | 57.4,16.88 57.26,16.48 | v57.4,16.43 57.26,16.48 | 57.4,16.88 57.55,16.48 | v57.4,16.43 57.55,16.48 | 57.4,16.88 57.26,16.48 | 57.26,16.48 | v57.4,16.43 57.26,16.48 | 57.4,16.88 57.55,16.48
  Top 0.305: v57.4,16.43 57.55,16.48 | 57.4,16.88 57.26,16.48 | v57.4,16.43 57.26,16.48 | 57.4,16.88 57.55,16.48 | v57.4,16.43 57.55,16.48 | 59.35,16.88 59.23,16.47 v59.37,16.43 | 59.35,16.88 59.51,16.49 v59.37,16.43 | 56.75,12.93 56.91,13.33 v56.77,13.38 | 56.75,12.93 56.63,13.34 v56.77,13.38 | 59.35,12.93 59.51,13.33 v59.37,13.38 | 59.35,12.93 59.23,13.34 v59.37,13.38
  Top 0.406: U4.6 16.32,21.18 | 16.32,21.18 v15.88,21.18 v15.88,21.19 | U2.6 16.32,28.8 | 16.32,28.8 v15.88,28.8 v15.88,28.81 | U1.6 16.32,36.42 | 16.32,36.42 v15.88,36.42 v15.88,36.43 | U5.6 16.32,13.56 | 16.32,13.56 v15.88,13.56 v15.88,13.57 | U12.2 40.58,13.06 | 40.58,13.06 v40.14,13.06 v40.13,13.06 | C66.2 38.79,10.59 | 38.79,10.59 v39.24,10.59 | C64.2 38.98,8.94 | 38.98,8.94 v39.43,8.94 | 16.32,21.18 15.9,21.29 v15.88,21.19 | 16.32,21.18 15.89,21.09 v15.88,21.19 | 16.32,28.8 15.9,28.91 v15.88,28.81 | 16.32,28.8 15.89,28.71 v15.88,28.81 | 16.32,36.42 15.9,36.53 v15.88,36.43 | 16.32,36.42 15.89,36.34 v15.88,36.43 | 16.32,13.56 15.9,13.67 v15.88,13.57 | 16.32,13.56 15.89,13.47 v15.88,13.57 | 40.58,13.06 40.16,13.16 v40.13,13.06 | 40.58,13.06 40.15,12.97 v40.13,13.06 | 38.79,10.59 39.22,10.49 | v39.24,10.59 39.22,10.49 | 38.79,10.59 39.22,10.68 | v39.24,10.59 39.22,10.68 | 38.79,10.59 39.22,10.49 | 38.79,10.59 39.22,10.68 | 38.79,10.59 39.22,10.49 | v39.24,10.59 39.22,10.49 | 38.79,10.59 39.22,10.68 | v39.24,10.59 39.22,10.68 | 38.98,8.94 39.41,8.84 | v39.43,8.94 39.41,8.84 | 38.98,8.94 39.41,9.03 | v39.43,8.94 39.41,9.03 | 38.98,8.94 39.41,8.84 | 38.98,8.94 39.41,9.03 | 38.98,8.94 39.41,8.84 | v39.43,8.94 39.41,8.84 | 38.98,8.94 39.41,9.03 | v39.43,8.94 39.41,9.03
  Top 0.508: v34.92,30.02 C25.2 | v35.12,28.5 35.96,28.5 C24.2 | v33.85,29.13 C3.2 | v33.91,27.54 32.94,27.54 C6.2 | v33.91,23.1 32.94,23.1 C9.2 | v33.85,21.51 C12.2 | C22.2 v24.64,32.88 | C60.1 v14.61,26.59 | C8.2 v14.61,24.05 | C61.1 v14.61,18.97 | C5.2 v14.61,31.67 | C59.1 v14.61,34.21 | C2.2 v14.61,39.29 | C11.2 v14.61,16.43 | C62.1 v14.61,11.35 | U8.2 38.08,36.24 C29.2 v37.34,34.59 | C26.2 v35.69,34.4 | C28.2 v38.73,33.45 | C65.2 v34.8,10.02 | R50.1 32.73,14.11 v32.7,14.08 | C32.2 v40.77,15.92 | 19.27,23.21 C21.2 20.26,22.23 v20.27,22.23 | C27.2 v38.73,39.04 | 19.27,23.29 R26.1 | FB1.1 25.31,42.08 v24.38,42.08 | C56.2 v54.36,26.27 | C49.2 v53.72,19.73 | v56.13,26.27 56.13,27.11 C55.2 | C53.2 v53.72,38.27 | C40.2 v62.04,37.32 | C45.2 v63.88,36.56 | C48.2 v63.88,30.34 | C43.2 v62.04,29.51 | C34.2 v62.04,18.84 | C46.2 v63.88,18.02 | C47.2 v63.88,11.79 | C37.2 v62.04,10.97 | C51.2 v56.13,7.73 | C52.2 v54.42,7.73
  Top 0.61: C57.2 v42.67,21.76 | C58.2 43.53,19.99 v42.55,19.99 | C31.2 v29.21,31.92
  Bottom 0.508: v20.27,22.23 20.32,22.27
  other vias: 2.54,45.64 2.54,43.1 2.54,40.56 12.7,45.64 12.7,43.1 12.7,40.56 15.24,43.1 15.24,45.64 17.78,45.64 20.32,45.64 20.32,43.1 17.78,43.1 15.24,40.56 15.24,32.94 12.7,32.94 10.16,32.94 7.62,32.94 5.08,32.94 2.54,32.94 2.54,25.32 5.08,25.32 7.62,25.32 10.16,25.32 12.7,25.32 15.24,25.32 12.7,7.54 15.24,7.54 12.7,10.08 15.24,10.08 17.78,10.08 20.32,7.54 17.78,7.54 12.7,5 15.24,5 17.78,5 20.32,5 20.32,2.46 17.78,2.46 15.24,2.46 12.7,2.46 22.86,7.54 22.86,5 22.86,2.46 25.4,7.54 25.4,12.62 22.86,12.62 22.86,15.16 25.4,15.16 30.48,12.62 30.48,15.16 30.48,17.7 30.48,20.24 33.02,17.7 35.56,17.7 35.56,20.24 38.1,17.7 40.64,17.7 43.18,17.7 40.64,20.24 2.54,17.7 5.08,17.7 7.62,17.7 10.16,17.7 12.7,17.7 5.08,12.62 2.54,10.08 5.08,10.08 7.62,10.08 10.16,10.08 2.54,5 2.54,2.46 25.4,2.46 25.4,5 27.94,7.54 27.94,5 27.94,2.46 30.48,2.46 30.48,5 30.48,7.54 33.02,7.54 33.02,5 33.02,2.46 35.56,2.46 35.56,5 35.56,7.54 33.02,10.08 38.1,7.54 38.1,5 38.1,2.46 40.64,2.46 40.64,5 40.64,7.54 40.64,10.08 43.18,10.08 43.18,7.54 43.18,5 43.18,2.46 45.72,2.46 45.72,5 45.72,7.54 45.72,10.08 48.26,10.08 48.26,7.54 48.26,5 48.26,2.46 50.8,5 50.8,2.46 53.34,5 53.34,2.46 55.88,2.46 55.88,5 58.42,5 58.42,2.46 60.96,5 60.96,2.46 63.5,2.46 63.5,5 66.04,2.46 66.04,5 68.58,2.46 68.58,5 68.58,7.54 66.04,7.54 63.5,7.54 63.5,10.08 66.04,10.08 60.96,12.62 60.96,17.7 73.66,17.7 76.2,17.7 63.5,20.24 71.12,7.54 73.66,12.62 76.2,12.62 76.2,22.78 73.66,22.78 71.12,22.78 68.58,22.78 66.04,22.78 66.04,20.24 66.04,17.7 63.5,22.78 60.96,22.78 60.96,25.32 63.5,25.32 66.04,25.32 68.58,25.32 71.12,25.32 73.66,25.32 76.2,25.32 66.04,27.86 63.5,27.86 60.96,30.4 66.04,30.4 73.66,30.4 76.2,30.4 73.66,35.48 76.2,35.48 60.96,35.48 53.34,35.48 50.8,35.48 50.8,32.94 53.34,40.56 55.88,40.56 63.5,38.02 66.04,38.02 50.8,12.62 50.8,15.16 50.8,17.7 48.26,38.02 48.26,40.56 48.26,43.1 50.8,43.1 53.34,43.1 53.34,45.64 50.8,45.64 55.88,45.64 55.88,43.1 58.42,43.1 58.42,45.64 60.96,45.64 60.96,43.1 63.5,43.1 63.5,45.64 63.5,40.56 66.04,40.56 66.04,43.1 66.04,45.64 68.58,45.64 68.58,43.1 68.58,40.56 71.12,40.56 15.24,17.7 43.18,30.4 43.18,27.86 40.64,27.86 38.1,32.94 35.56,32.94 33.02,32.94 33.02,35.48 30.48,35.48 38.1,38.02 38.1,40.56 35.56,40.56 35.56,43.1 33.02,43.1 30.48,43.1 30.48,45.64 33.02,45.64 22.86,43.1 22.86,45.64 25.4,38.02 25.4,35.48 22.86,35.48 22.86,38.02 5.08,38.02 5.08,40.56 20.32,38.02
  pour Bottom: 0,-0.08 0,48.18 78.23,48.18 78.23,-0.08
  pour Top: 0,47.93 77.98,47.93 77.98,-0.08 0,-0.08
N$1
  Top 0.203: U1.4 12.46,35.77 12.02,35.33 10.33,35.33 C1.1 | C1.1 | R1.2 9.65,35.99 C1.1
N$2
  Top 0.203: R2.2 9.63,37.51 C1.2 10.33,38.17 12.02,38.17 12.46,37.73 U1.1
N$3
  Top 0.203: U1.2 11.65,37.08 R3.1
N$4
  Top 0.203: U1.3 11.65,36.42 R3.2
N$5
  Top 0.152: 12.7,28.16 U2.4 | C4.1
  Top 0.203: R4.2 9.63,28.37 C4.1 | 12.7,28.16 12.46,28.16 12.02,27.71 10.33,27.71 C4.1
N$6
  Top 0.203: R5.2 9.63,29.89 C4.2 10.33,30.55 12.02,30.55 12.46,30.11 U2.1
N$7
  Top 0.203: U2.2 11.65,29.45 R6.1
N$8
  Top 0.203: U2.3 11.65,28.8 R6.2
N$11
  Top 0.152: 12.7,20.54 U4.4
  Top 0.203: 12.7,20.54 12.46,20.54 12.02,20.09 10.33,20.09 C7.1 9.63,20.75 R7.2
N$12
  Top 0.203: U4.1 12.46,22.48 12.02,22.93 10.33,22.93 C7.2 9.63,22.27 R8.2
N$13
  Top 0.203: U4.2 11.65,21.84 R9.1
N$14
  Top 0.203: U4.3 11.65,21.18 R9.2
N$17
  Top 0.203: R10.2 9.63,13.13 C10.1 10.33,12.47 12.02,12.47 12.46,12.91 U5.4
N$18
  Top 0.203: R11.2 9.63,14.65 C10.2 10.33,15.31 12.02,15.31 12.46,14.87 U5.1
N$19
  Top 0.203: U5.2 11.65,14.21 R12.1
N$20
  Top 0.203: U5.3 11.65,13.56 R12.2
N$23
  Top 0.203: U1.7 18.29,37.08 20.29,39.07 26.51,39.07 26.98,38.59 C13.-
  Top 0.406: 26.98,38.59 27.14,37.92 C13.- 27.66,38.44 26.98,38.59
N$24
  Top 0.203: R13.1 27.72,35.19 27.72,35.83 C13.+
  Top 0.406: 27.72,35.19 27.96,35.84 C13.+ 27.25,35.69 27.72,35.19
N$27
  Top 0.203: C14.- 21.02,37.45 19.81,36.24 19.81,31.11 18.16,29.45 U2.7
  Top 0.406: 21.02,37.45 21.69,37.6 C14.- 21.17,38.12 21.02,37.45
N$28
  Top 0.203: C14.+ 21.59,35.17 21.59,33.23 R14.1
  Top 0.406: 21.59,35.17 21.96,35.76 C14.+ 21.22,35.76 21.59,35.17
N$29
  Top 0.203: C15.- 21.02,13.2 19.53,14.68 19.53,20.47 18.16,21.84 U4.7
  Top 0.406: 21.02,13.2 21.17,12.52 C15.- 21.69,13.04 21.02,13.2
N$30
  Top 0.203: R15.1 21.56,15.46 21.56,14.69 C15.+
  Top 0.406: 21.56,15.46 21.21,14.87 C15.+ 21.95,14.9 21.56,15.46
N$31
  Top 0.203: U5.7 18.29,14.21 20.86,11.64 26.71,11.64 27.11,12.04 C16.-
  Top 0.406: 27.11,12.04 27.78,12.2 C16.- 27.27,12.72 27.11,12.04
N$32
  Top 0.203: R16.1 27.72,15.46 27.72,14.69 C16.+
  Top 0.406: 27.72,15.46 27.33,14.9 C16.+ 28.06,14.87 27.72,15.46
N$33
  Top 0.203: R22.2 32.88,26.08 C6.1 33.43,25.56 36.05,25.56 36.33,25.84 U7.4
N$34
  Top 0.203: U6.6 23.34,29.7 R18.1 23.15,31.48 C19.1 23.15,31.61 R14.2
N$35
  Top 0.203: R16.2 26.13,18.78 C18.1 26.13,18.91 R20.1 25.94,20.69 U6.13
N$36
  Top 0.203: R24.1 30.7,23.41 26.8,23.41 26.59,23.21 U6.14 26.59,21.62 R20.2 27.72,18.91 C18.2
N$37
  Top 0.203: U6.9 23.34,20.69 R19.1 23.15,18.91 | 23.15,18.91 C17.1 | R15.2 23.15,18.91
N$38
  Top 0.203: R23.1 24.07,24.56 22.69,23.17 U6.8 22.69,21.62 R19.2 21.56,18.91 C17.2
N$39
  Top 0.203: C19.2 21.56,31.35 R18.2 22.69,28.76 U6.7 22.69,27.3 23.9,26.08 R22.1
N$40
  Top 0.203: U6.2 25.94,29.7 R17.1 26.13,31.48 C20.1 26.13,31.61 R13.2
N$41
  Top 0.203: R21.1 30.65,27.18 26.84,27.18 26.59,27.43 U6.1 26.59,28.76 R17.2 27.72,31.35 C20.2
N$42
  Top 0.203: R23.2 32.88,24.56 C9.1 32.95,24.49 34.61,24.49 36.33,22.77 U7.7
N$43
  Top 0.203: U7.6 35.83,21.53 34.8,20.49 32.4,20.49 C12.1 31.4,21.53 R24.2
N$44
  Top 0.203: R21.2 31.4,29.11 C3.1 32.2,29.95 33.81,29.95 34.53,29.23 34.53,28.26 35.83,26.95 U7.5
N$45
  Top 0.203: R43.2 63.83,14.14 C47.1 65.49,14.19 68.71,10.97 X1.2
  Top 0.406: 68.71,10.97 68.86,9.79 X1.2 69.88,10.82 68.71,10.97
N$46
  Top 0.203: C34.1 61.99,21.29 R30.1 60.48,21.19 R31.1 R29.2
N$47
  Top 0.203: U7.9 37.33,20.47 R27.1
N$48
  Top 0.508: FB2.2 27.94,44.62 | 27.94,44.62 J7.1 | 27.94,44.62 28.45,45.18 J7.1 | 27.94,44.62 27.43,45.18 J7.1
N$49
  Top 0.508: FB1.2 25.4,44.62 | 25.4,44.62 J7.2 | 25.4,44.62 25.91,45.18 J7.2 | 25.4,44.62 24.89,45.18 J7.2
N$50
  Top 0.508: U8.4 41.5,34.57 41.13,34.19 C28.1
N$52
  Top 0.203: U9.2 58.7,19.27 C33.1 60.55,19.73 R30.2
N$53
  Top 0.203: R31.2 57.67,21.14 C33.2 58.05,19.35 U9.3 58.05,16.54 58.93,15.67 R42.1
N$54
  Top 0.203: C35.- 51.36,22.53 57.5,22.53 R29.1
  Top 0.406: 51.36,22.53 50.77,22.89 C35.- 50.77,22.16 51.36,22.53
N$55
  Top 0.203: C37.1 61.99,8.52 R33.1 60.48,8.62 R34.1 R32.2
N$56
  Top 0.203: R33.2 59.2,10.11 C36.1 58.7,10.54 U9.13
N$57
  Top 0.203: R43.1 58.93,14.14 58.05,13.27 U9.12 58.05,10.46 C36.2 57.62,10.03 R34.2
N$58
  Top 0.203: R32.1 51.35,7.16 50.67,7.16 C38.-
  Top 0.406: 51.35,7.16 50.83,7.61 C38.- 50.72,6.89 51.35,7.16
N$59
  Top 0.203: R35.2 R37.1 59.25,39.77 R36.1 60.63,39.72 C40.1
N$60
  Top 0.203: R36.2 59.26,38.18 59.17,38.27 | 59.17,38.27 C39.1 | U10.2 58.7,37.8 59.17,38.27
N$61
  Top 0.203: R41.1 58.93,34.21 58.05,35.08 U10.3 58.05,37.9 C39.2 57.67,39.68 R37.2
N$62
  Top 0.203: C41.- 50.93,41.2 51.26,41.2 R35.1
  Top 0.406: 51.26,41.2 50.58,41.24 C41.- 50.92,40.6 51.26,41.2
N$63
  Top 0.203: R38.2 R40.1 60.48,27.16 R39.1 60.63,27.11 C43.1
N$64
  Top 0.203: U10.13 58.7,29.08 C42.1 60.55,28.62 R39.2
N$65
  Top 0.203: R44.1 58.93,32.69 58.05,31.81 U10.12 58.05,29 C42.2 57.67,27.21 R40.2
N$66
  Top 0.203: C44.- 50.93,25.7 51.26,25.7 R38.1
  Top 0.406: 51.26,25.7 50.92,26.3 C44.- 50.58,25.65 51.26,25.7
N$67
  Top 0.203: R41.2 62.56,34.16 C45.1 65.28,34.16 68.71,37.59 X2.5
  Top 0.406: 68.71,37.59 69.88,37.73 X2.5 68.86,38.76 68.71,37.59
N$68
  Top 0.203: R42.2 63.83,15.67 C46.1 65.28,15.62 68.71,19.05 X1.5
  Top 0.406: 68.71,19.05 69.88,19.19 X1.5 68.86,20.22 68.71,19.05
N$70
  Top 0.203: R44.2 63.83,32.69 C48.1 65.49,32.73 68.71,29.51 X2.2
  Top 0.406: 68.71,29.51 68.86,28.33 X2.2 69.88,29.36 68.71,29.51
N$71
  Top 0.203: C50.1 54.61,14.16 55.45,13.32 U9.8
N$72
  Top 0.203: C50.2 54.61,15.65 55.45,16.49 U9.7
N$73
  Top 0.305: U9.6 56.1,19.72 C49.1
N$75
  Top 0.203: U9.5 56.75,15.27 56.1,14.62 U9.9
  Top 0.305: U9.9 56.1,10.16 C51.1
  Top 0.508: R45.1 54.42,11.38 C52.1 54.7,10.16 56.1,10.16
N$76
  Top 0.203: U10.8 55.45,31.92 54.67,32.7 C54.1
N$77
  Top 0.203: U10.7 55.45,34.97 54.67,34.19 C54.2
N$78
  Top 0.305: U10.6 56.1,38.26 C53.1
N$80
  Top 0.203: U10.5 56.75,34.32 56.1,33.67 U10.9
  Top 0.305: U10.9 56.1,28.7 C55.1
  Top 0.508: R47.1 53.88,29.45 C56.1 54.66,28.67 C55.1
N$81
  Top 0.203: R49.1 R50.2
  Top 0.254: R49.1 35.81,14.94 35.81,14.14 36.25,13.71 U12.6
N$82
  Top 0.203: U12.8 38.14,12.41 40.09,14.36 U12.4
  Top 0.406: U12.8 36.92,10.66 C66.1 36.85,9.05 C64.1 | U12.4 41.87,14.36 42.67,15.16 43.69,15.16 R51.2
N$83
  Top 0.406: U12.1 42.95,12.41 C63.1
N$85
  Top 0.406: U12.3 42.76,13.71 C63.2
N$86
  Top 0.406: U12.5 37.8,14.36 38.37,14.92 C32.1
SCLK
  Top 0.152: U7.10 37.83,23.02 38.12,23.3 U11.10 42.36,23.41 43.48,23.41 45.21,25.14 45.21,26.84 46.48,28.11 46.48,42.34 43.9,44.92 J6.4
  Top 0.305: 43.9,44.92 43.96,45.56 J6.4 43.26,44.86 43.9,44.92
V_BATT
  Top 0.203: U8.1 39.69,37.19 40.39,36.5 40.39,35.99 39.69,35.29 U8.3
  Top 0.508: U8.1 38.54,37.19 38.34,36.99 C29.1 37.22,37.1 C26.1
  Top 1.016: FB2.1 31.62,42 C30.+ 35.62,37.99 C26.1

### Text on the board
tPlace: A- | A+ | B- | B+ | C- | C+ | D- | D+ | GND | BIOSIGNAL DAQ V1.0
bPlace: BATT | GND | ADC_!CS | DIN | DAC_!CS | SCLK | DOUT | GND
tDocu: FB1 | FB2 | C41 | C30 | C14 | C13 | U8 | U10 | C44 | U6 | U7 | U11 | C35 | U9 | C15 | C16 | U12 | C38